# EasyEDA Pro project ProPrj_三轮车_2025-08-24.epro, schematic Schematic1

## Sheets
1 P1: Board Name: 主控板; Create Date: 2024-12-28; Page Name: P1; Project Name: 三轮车; Schematic Name: Schematic1; Update Date: 2025-01-05; Company: 嘉立创EDA; Page Size: A4; Version: V1.0
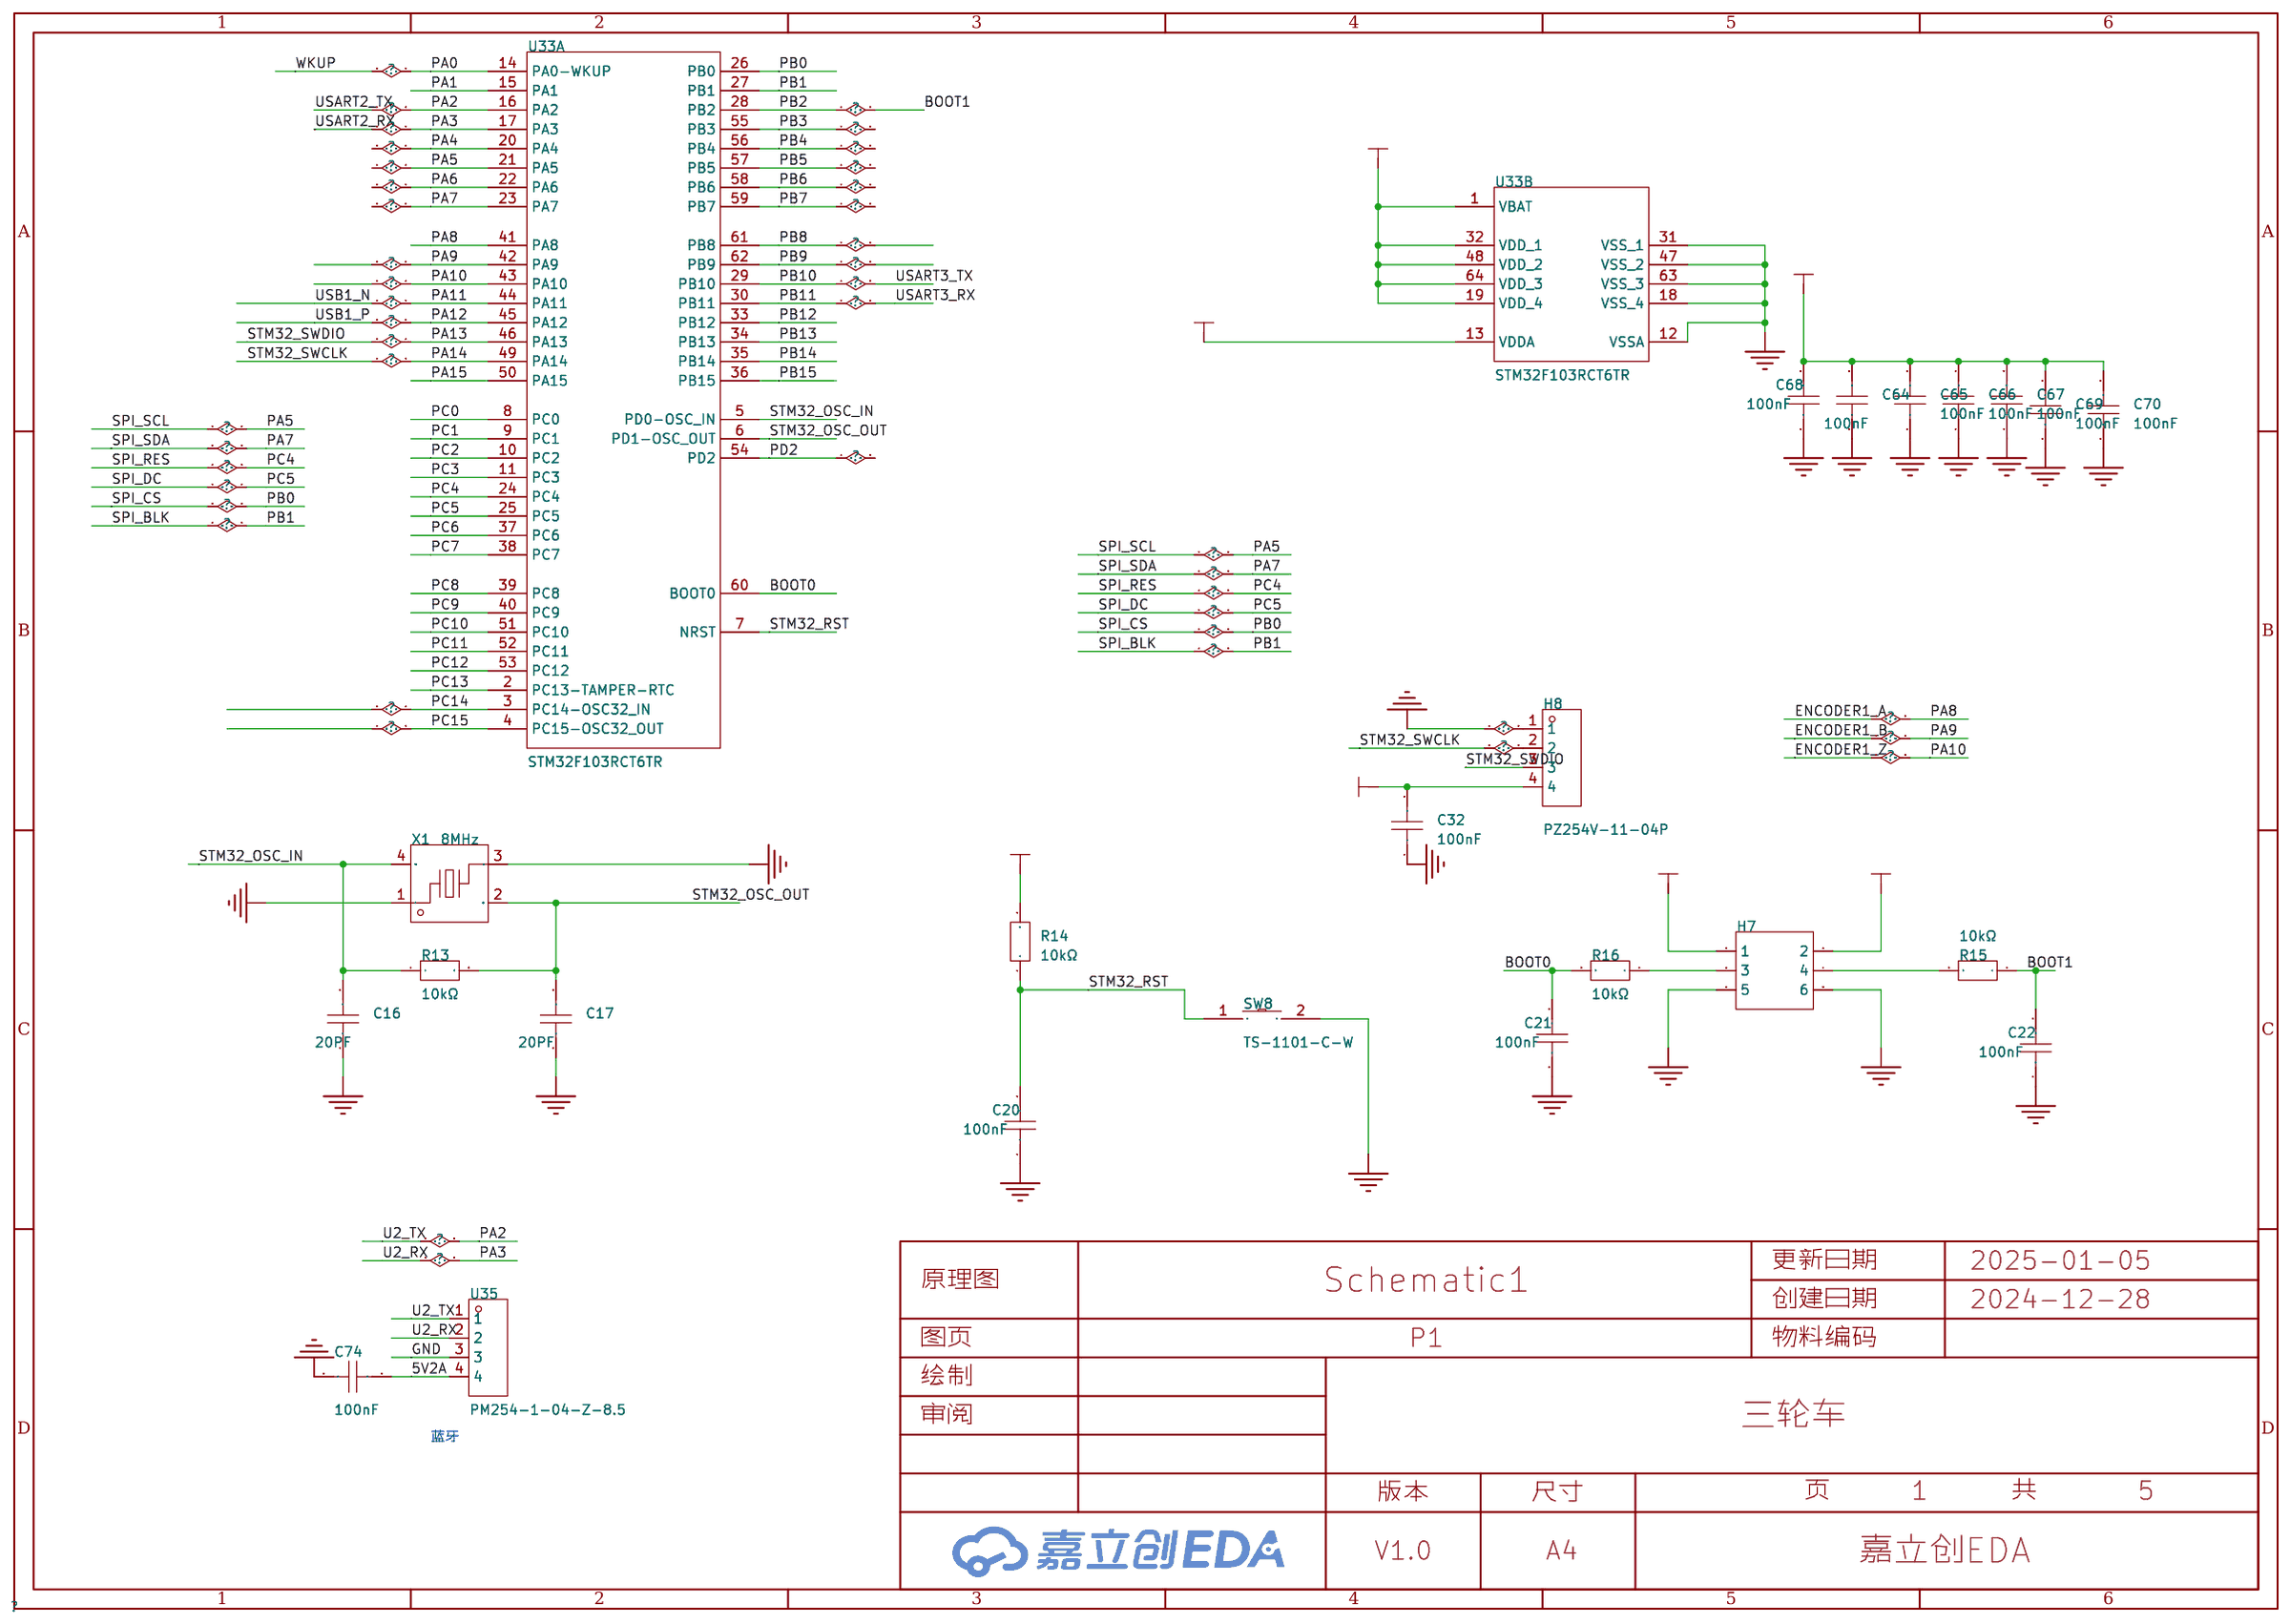
[diagram p0: P1]
2 P3: Page Name: P3; Update Date: 2025-01-06
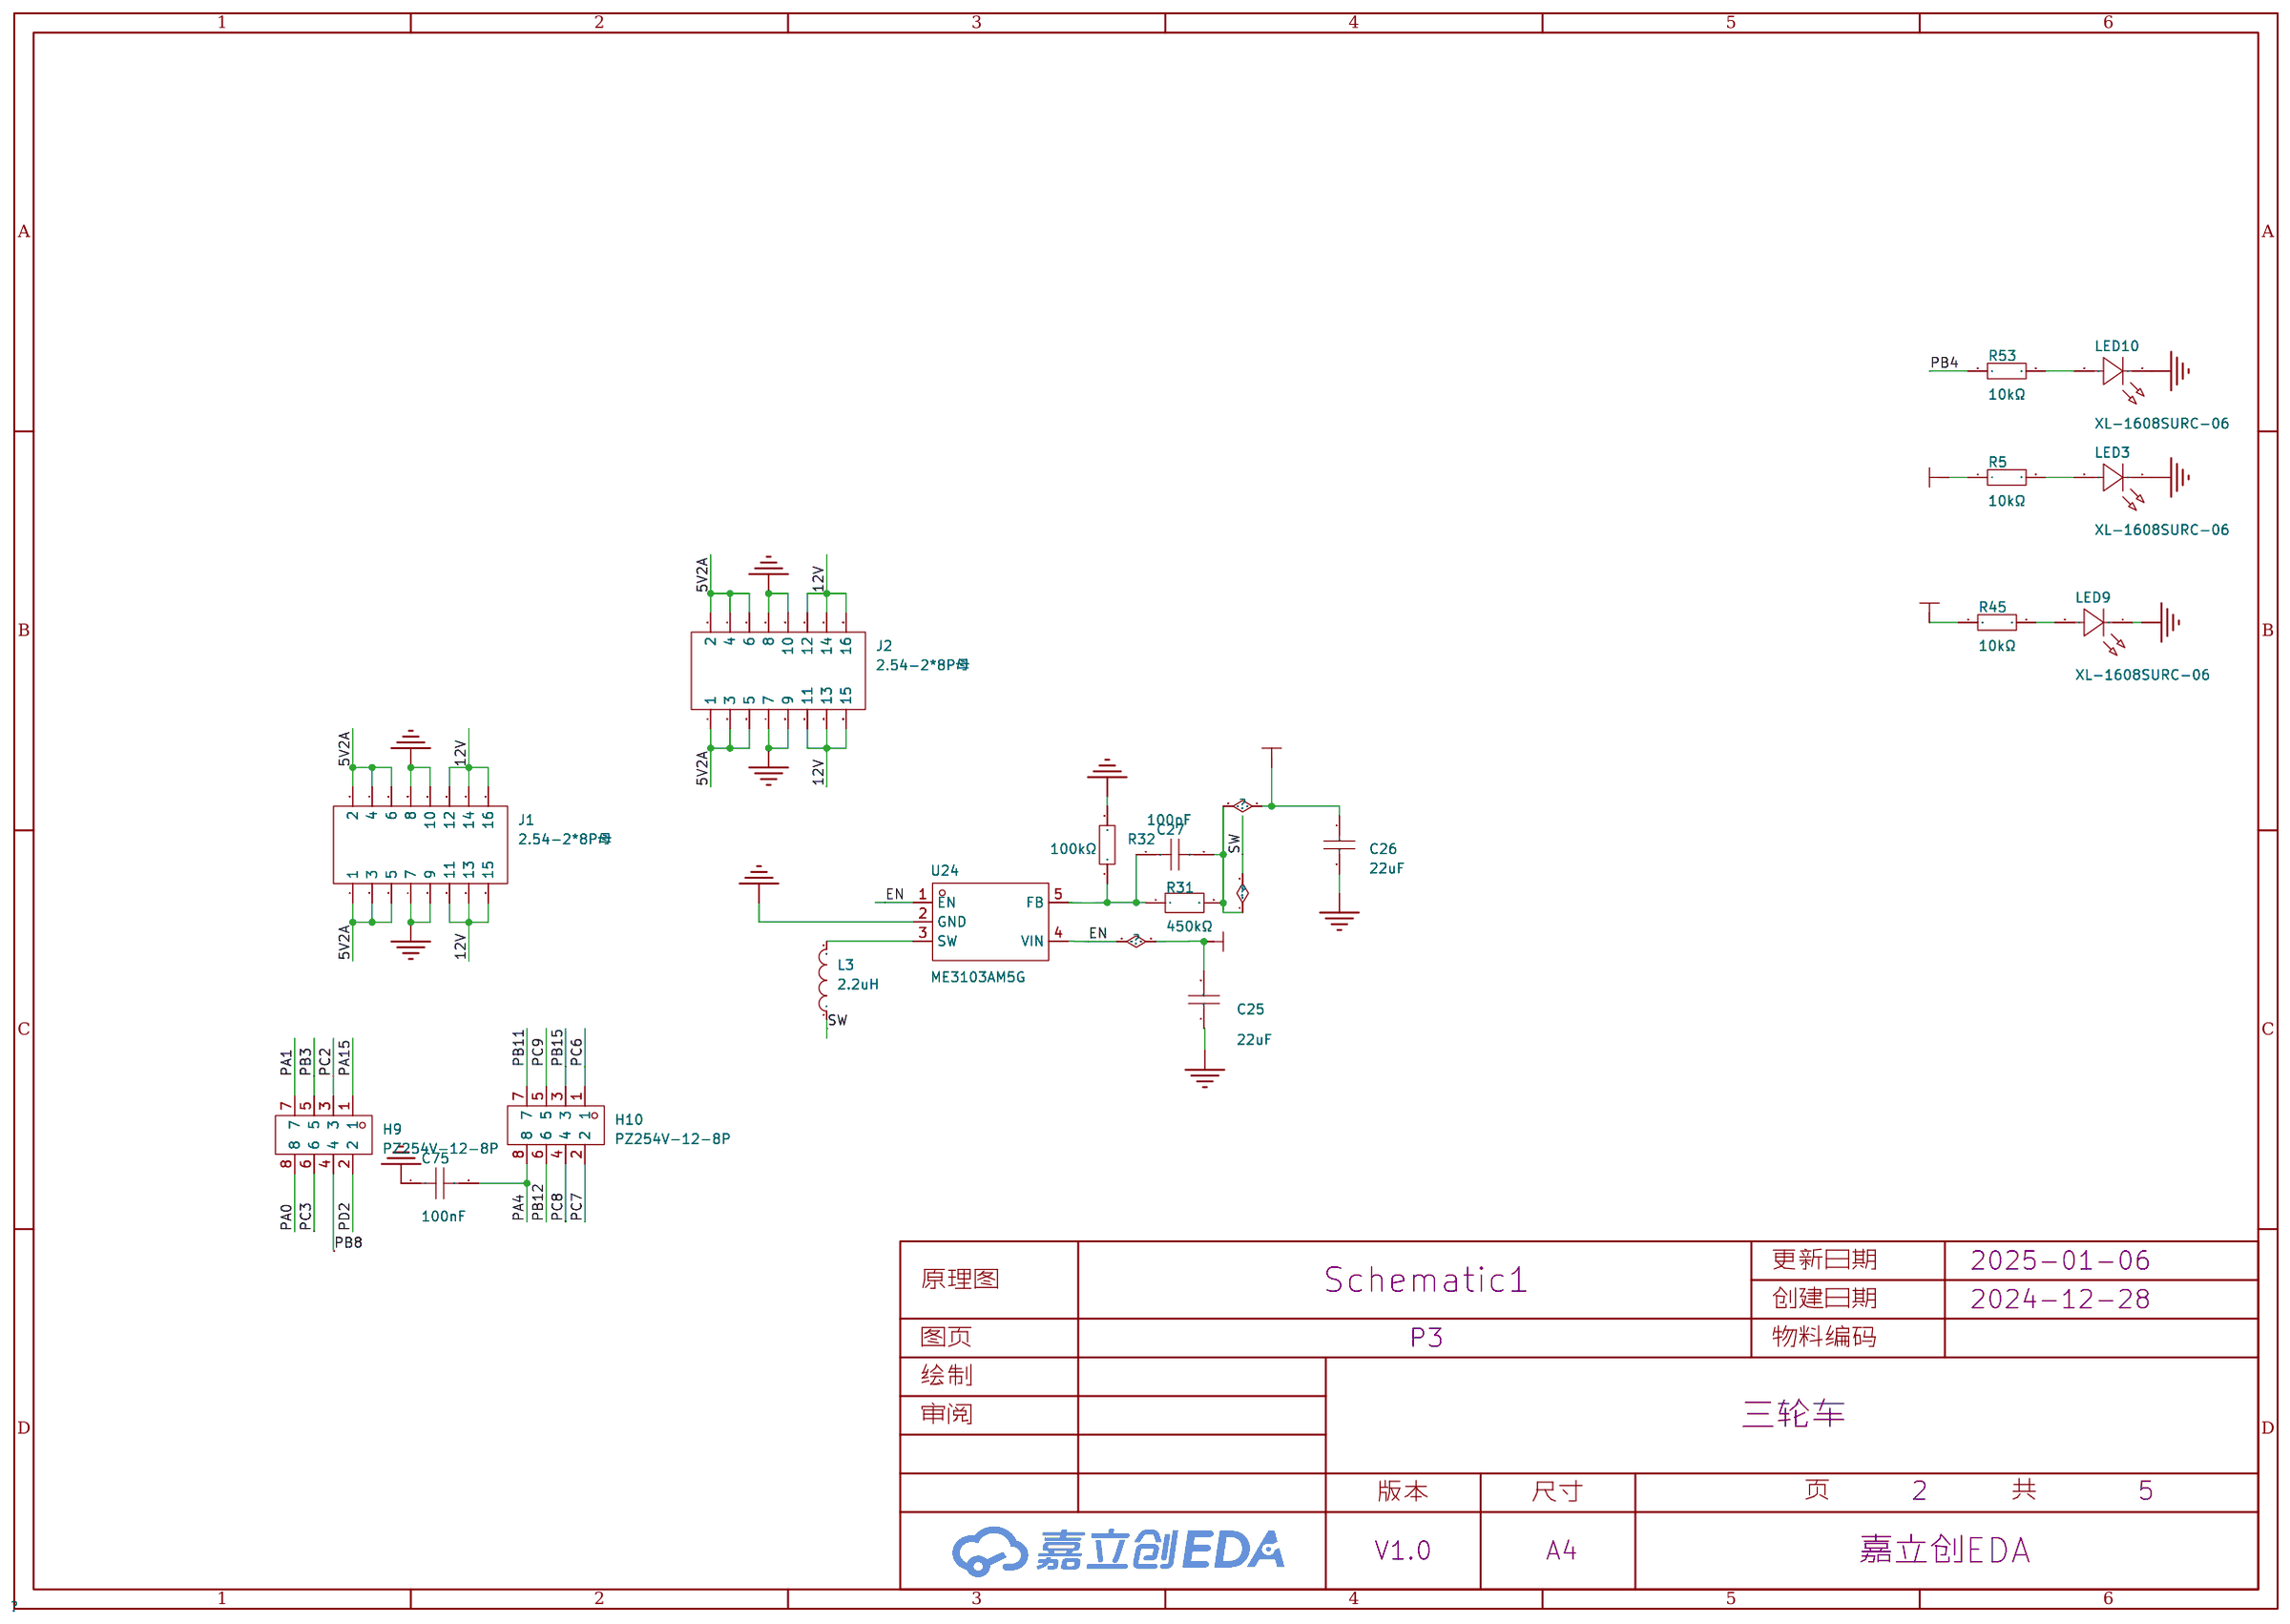
[diagram p1: P3]
3 P5: Page Name: P5
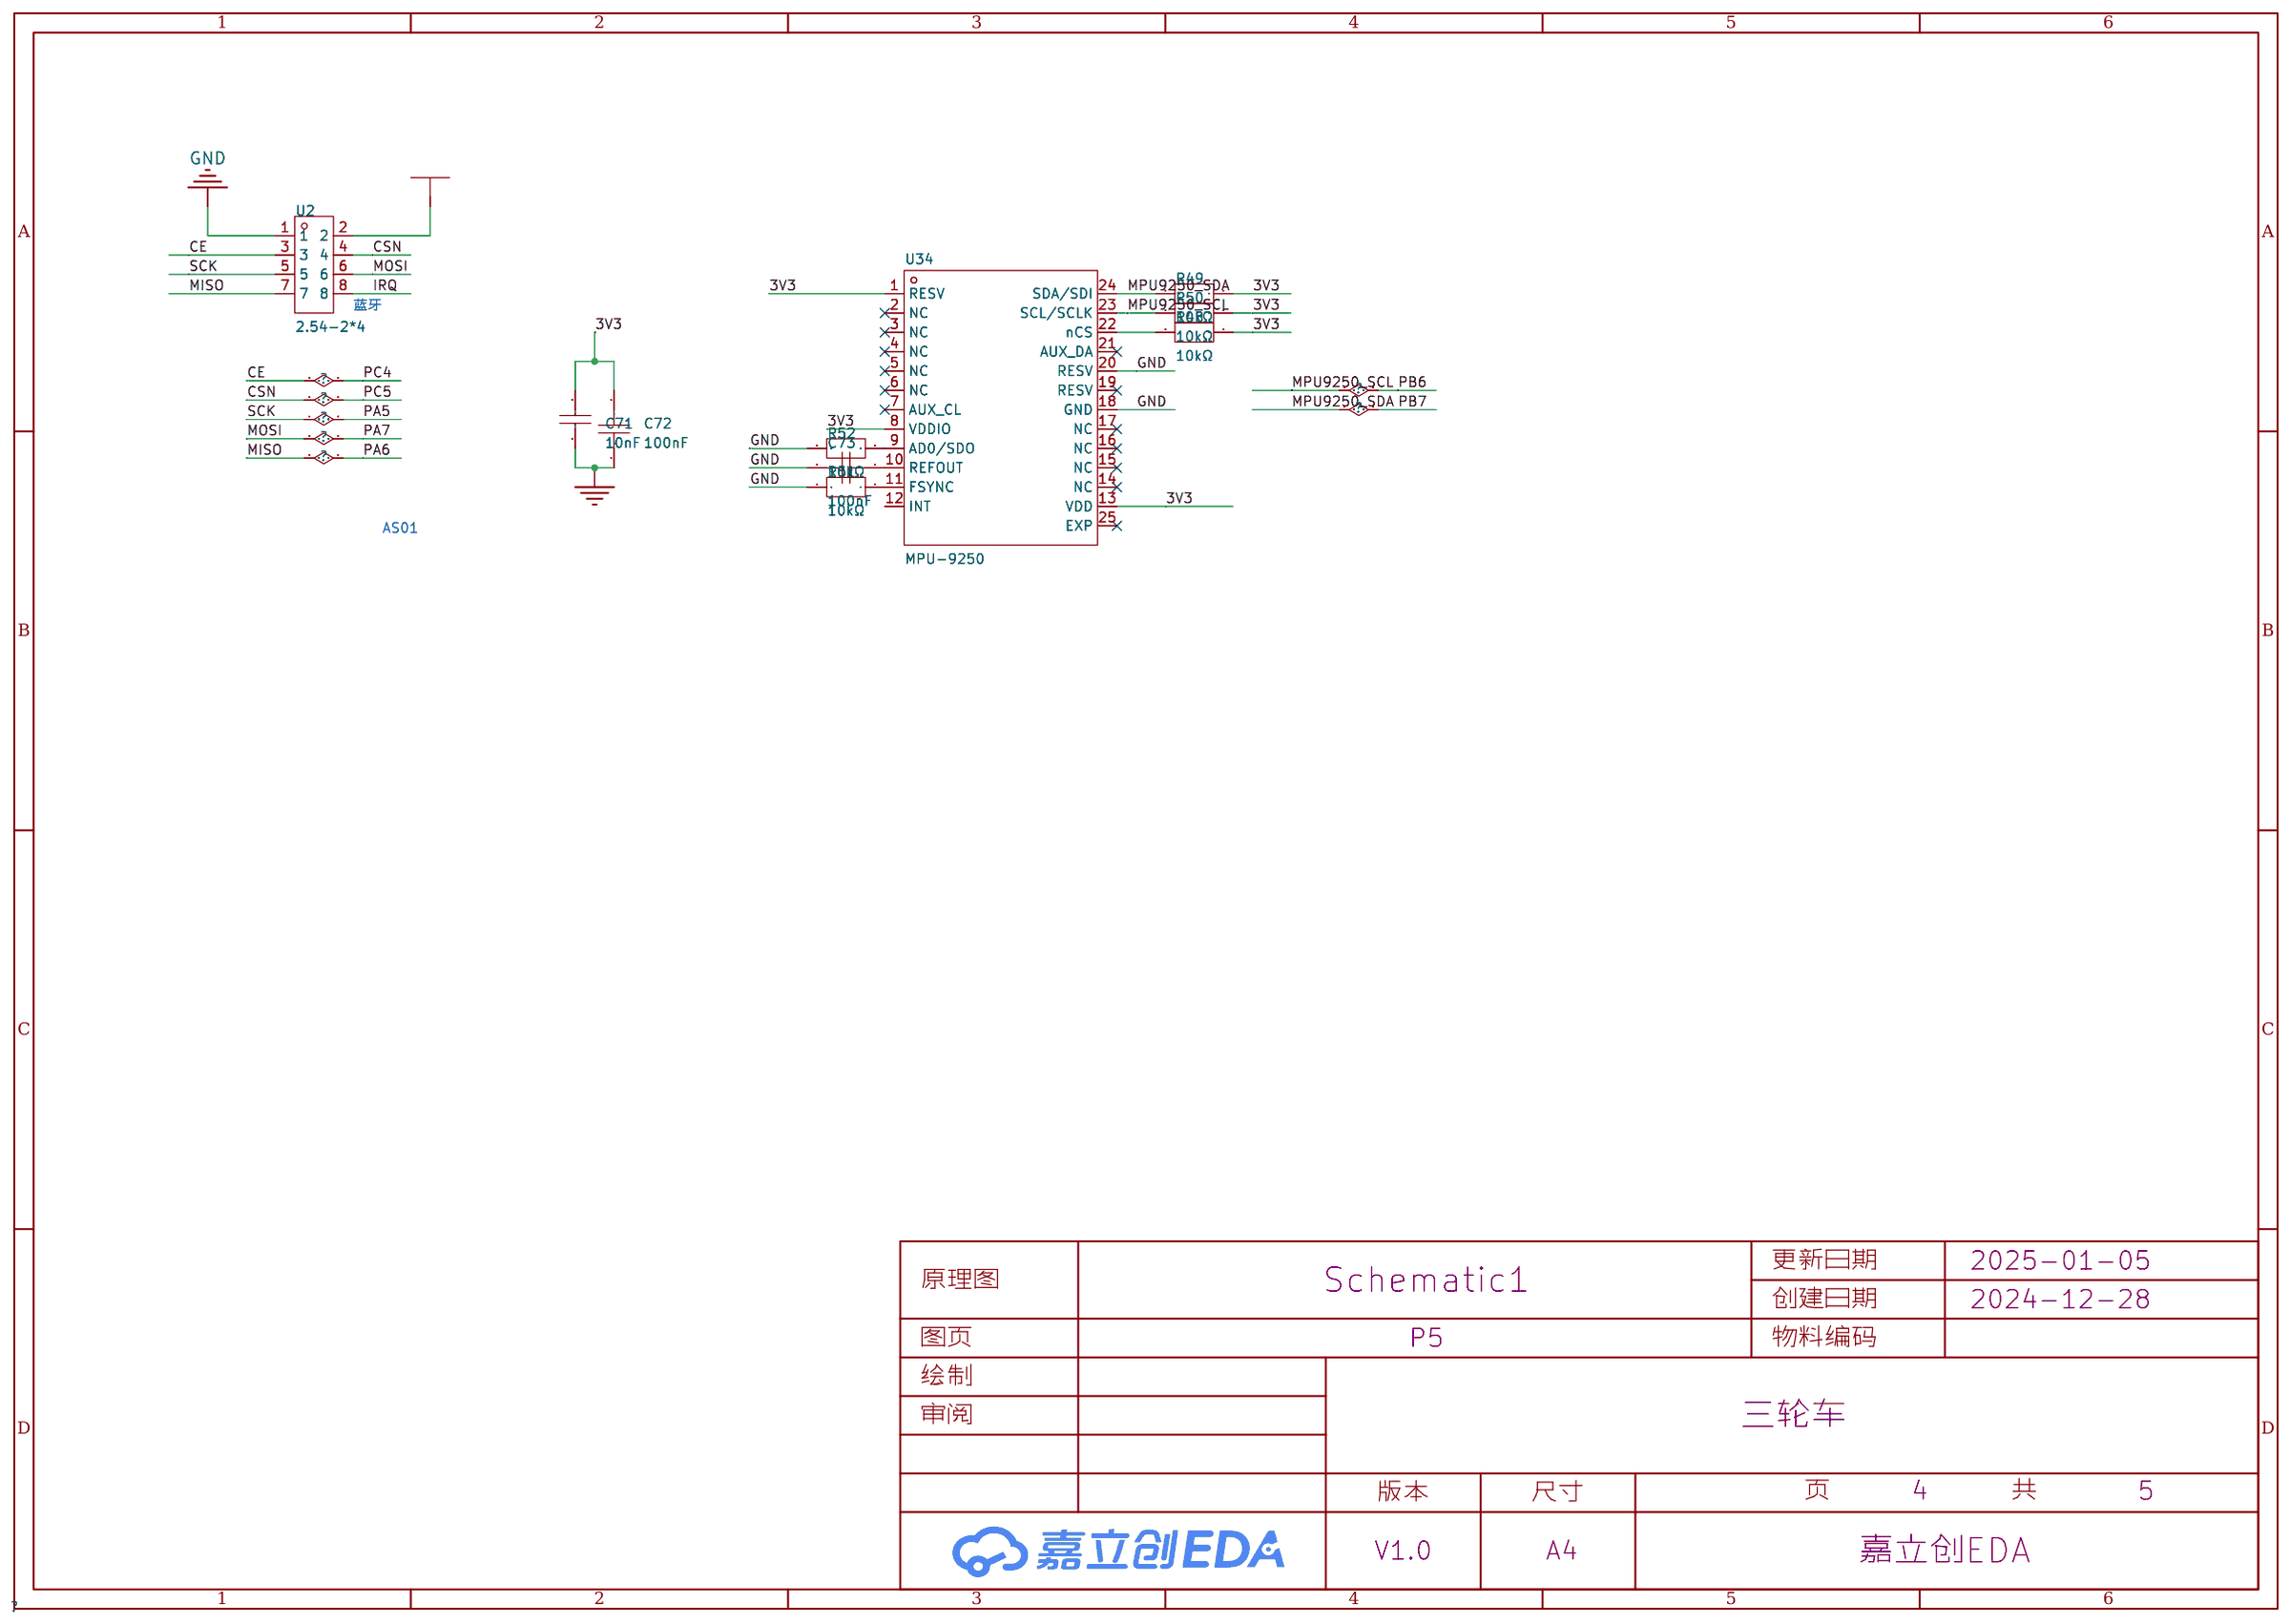
[diagram p2: P5]
4 P6: Create Date: 2025-01-01; Page Name: P6
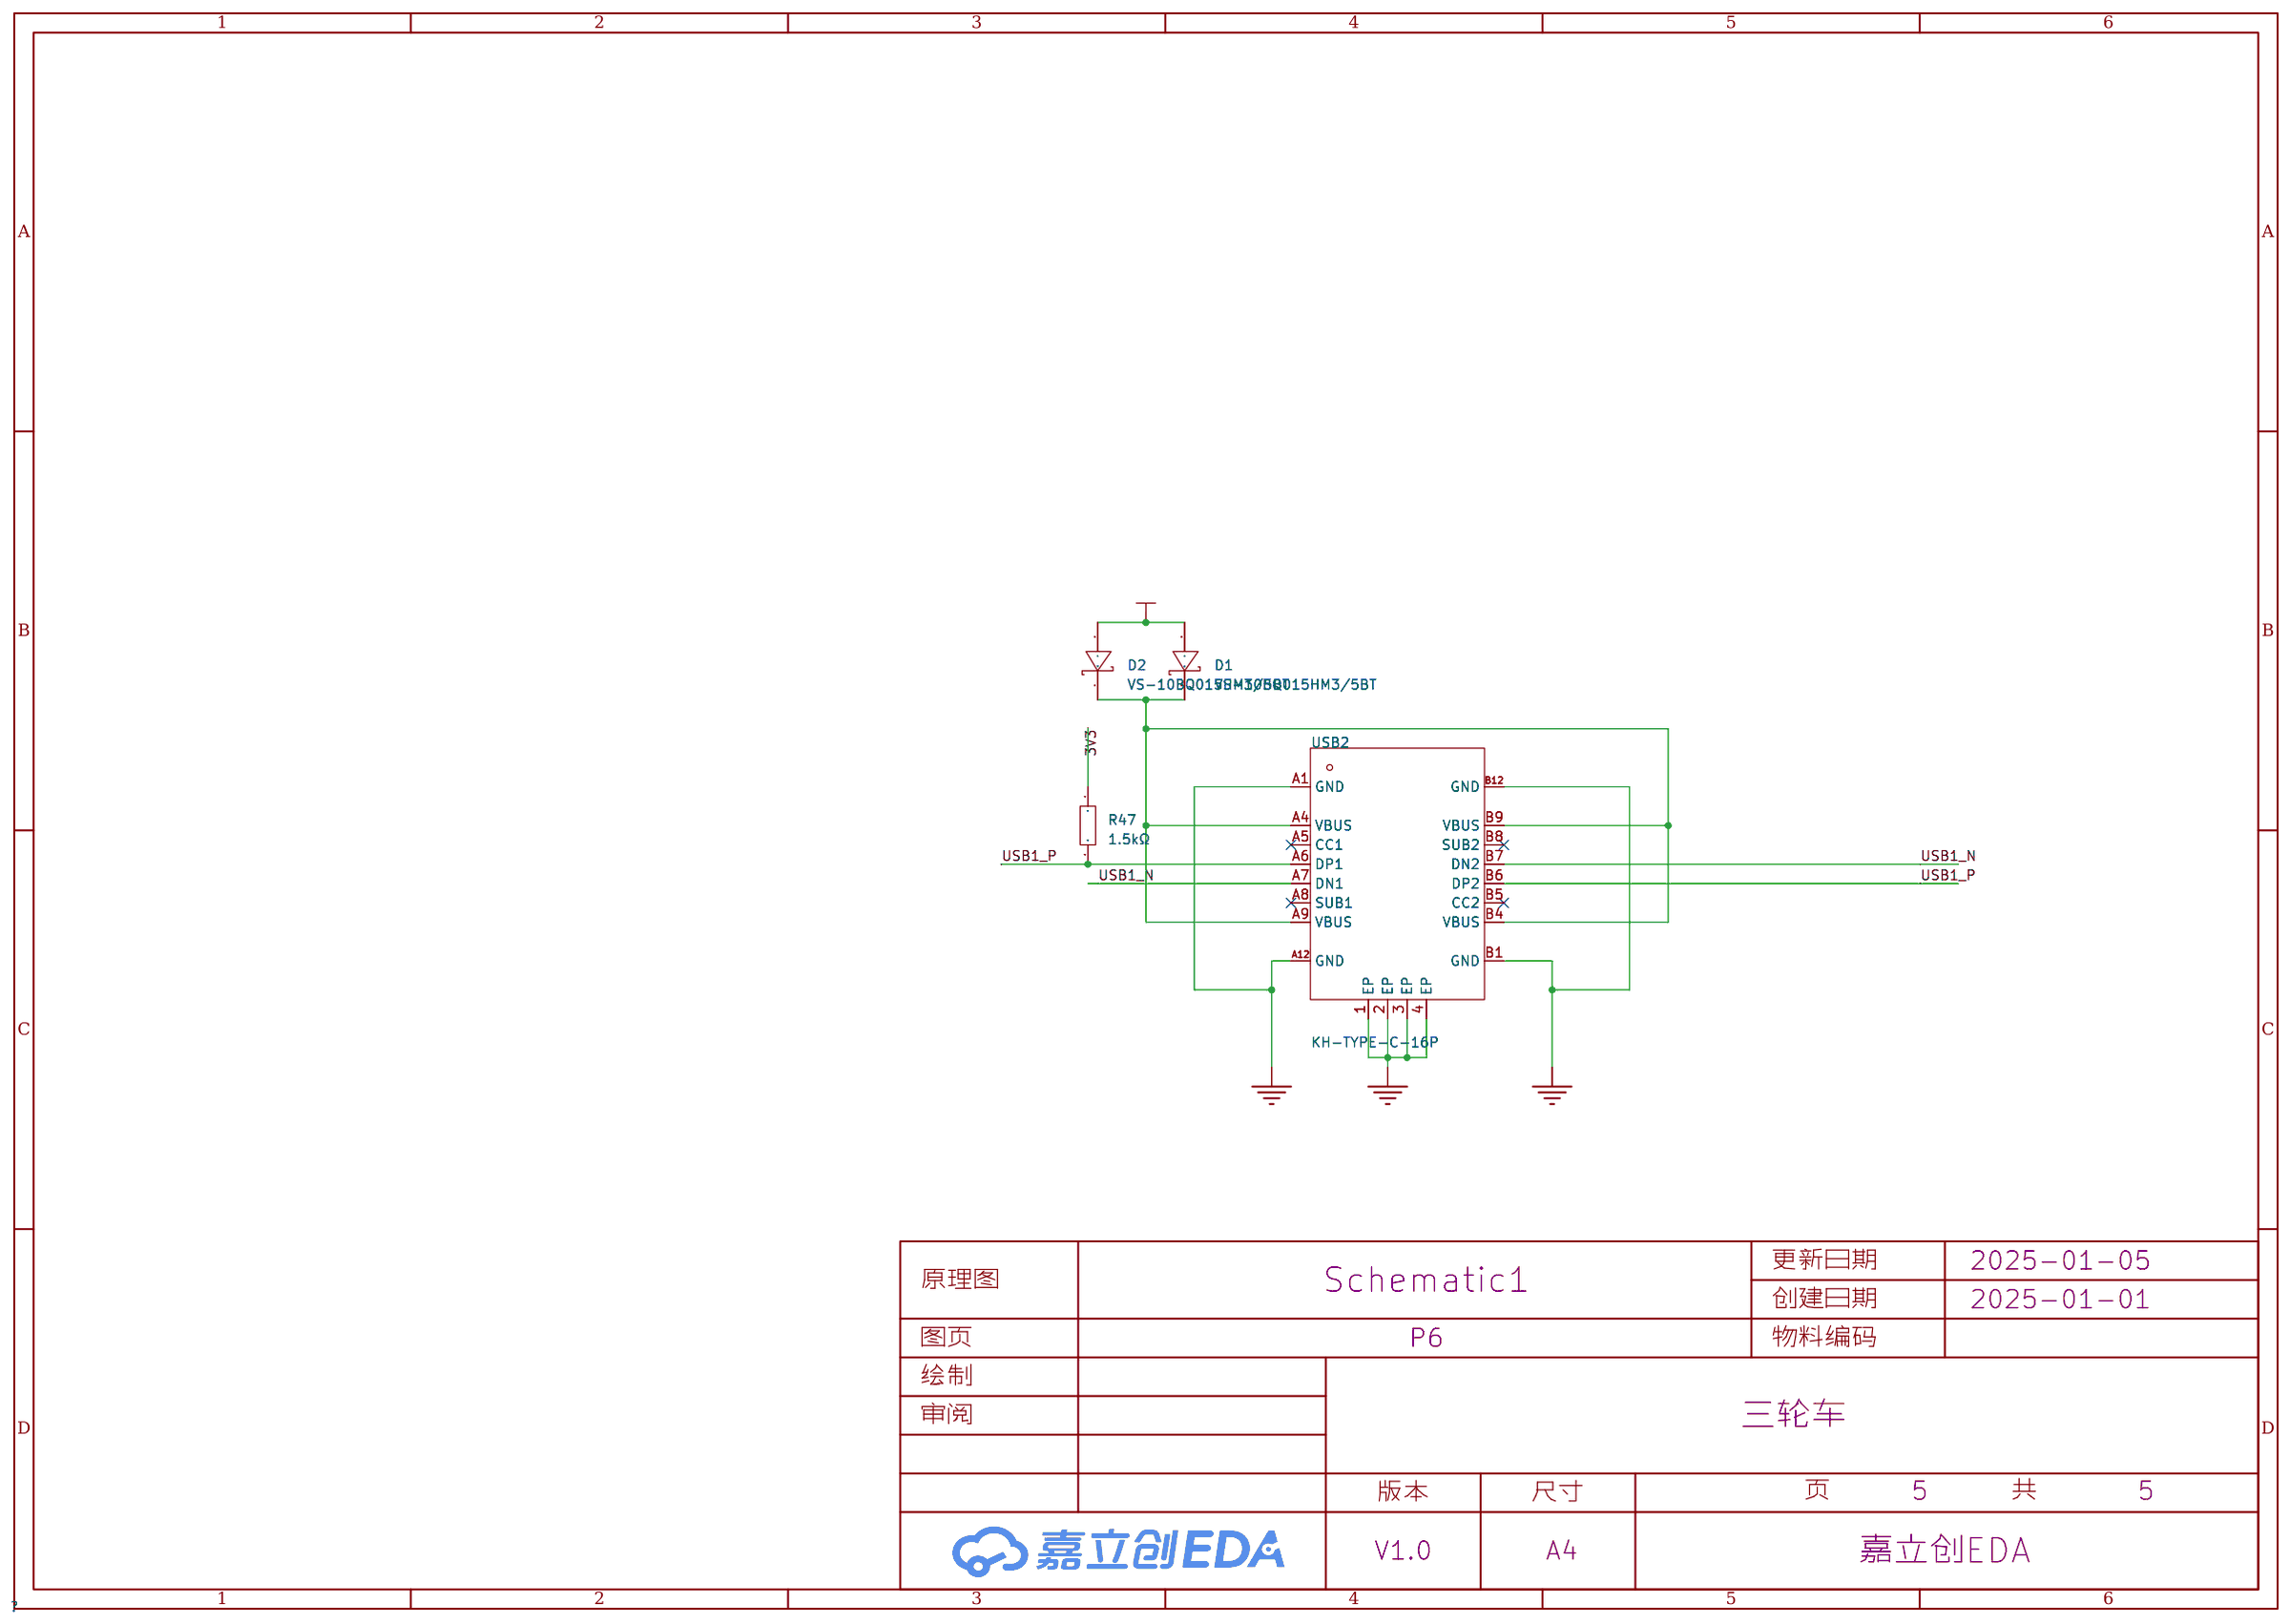
[diagram p3: P6]

## Parts
sheet P1
C16  20PF  [C0603]
C17  20PF  [C0603]
C20  100nF  [C0603]
C21  100nF  [C0603]
C22  100nF  [C0603]
C32  100nF  [C0603]
C64  100nF  [C0603]
C65  100nF  [C0603]
C66  100nF  [C0603]
C67  100nF  [C0603]
C68  100nF  [C0603]
C69  100nF  [C0603]
C70  100nF  [C0603]
C74  100nF  [C0603]
H7  -  [HDR-TH_6P-P2.54-V-F-R2-C3-S2.54]
H8  PZ254V-11-04P  [HDR-TH_4P-P2.54-V-M]
R13  10kΩ  [R0603]
R14  10kΩ  [R0603]
R15  10kΩ  [R0603]
R16  10kΩ  [R0603]
SW8  TS-1101-C-W  [SW-SMD_L6.0-W3.3-LS8.0]
U33  STM32F103RCT6TR  [LQFP-64_L10.0-W10.0-P0.50-LS12.0-BL]  (sections 1,2)
U35  PM254-1-04-Z-8.5  [HDR-TH_4P-P2.54-V-F]
X1  8MHz  [CRYSTAL-SMD_4P-L3.2-W2.5-BL]
sheet P3
C25  22uF  [C1206]
C26  22uF  [C1206]
C27  100pF  [C0603]
C75  100nF  [C0603]
H9  PZ254V-12-8P  [HDR-TH_8P-P2.54-V-M-R2-C4-S2.54]
H10  PZ254V-12-8P  [HDR-TH_8P-P2.54-V-M-R2-C4-S2.54]
J1  2.54-2*8P母  [HDR-TH_16P-P2.54-V-F-R2-C8-S2.54]
J2  2.54-2*8P母  [HDR-TH_16P-P2.54-V-F-R2-C8-S2.54]
L3  2.2uH  [IND-SMD_L2.5-W2.0_MHCD252012A]
LED3  XL-1608SURC-06  [LED0603-RD_RED]
LED9  XL-1608SURC-06  [LED0603-RD_RED]
LED10  XL-1608SURC-06  [LED0603-RD_RED]
R5  10kΩ  [R0603]
R31  450kΩ  [R0402]
R32  100kΩ  [R0603]
R45  10kΩ  [R0603]
R53  10kΩ  [R0603]
U24  ME3103AM5G  [SOT-23-5_L3.0-W1.7-P0.95-LS2.8-BR]
sheet P5
C71  10nF  [C0603]
C72  100nF  [C0603]
C73  100nF  [C0603]
R48  10kΩ  [R0603]
R49  10kΩ  [R0603]
R50  10kΩ  [R0603]
R51  10kΩ  [R0603]
R52  10kΩ  [R0603]
U2  2.54-2*4  [HDR-TH_8P-P2.54-V-F-R2-C4-S2.54]
U34  MPU-9250  [QFN-24_L3.0-W3.0-P0.40-BL-EP]
sheet P6
D1  VS-10BQ015HM3/5BT  [SMB_L4.6-W3.6-LS5.3-RD]
D2  VS-10BQ015HM3/5BT  [SMB_L4.6-W3.6-LS5.3-RD]
R47  1.5kΩ  [R0603]
USB2  KH-TYPE-C-16P  [usb-c-smd_kh-type-c-16p]

## Library data of the parts
C16 C17 C20-C22 C32 C64-C70 C74 C75 = CC0603KRX7R9BB104: 容值:100nF;精度:±10%;额定电压:50V;材质(温度系数):X7R;; LCSC Part Name: 100nF ±10% 50V; Supplier Part: C14663; Manufacturer: YAGEO(国巨); Supplier Footprint: 0603; JLCPCB Part Class: Basic Part; Datasheet: https://atta.szlcsc.com/upload/public/pdf/source/20180910/C282072_33301C7F631E79921B82A8DAC6BCC5B3.pdf; Supplier: LCSC; Tolerance: ±10%; Voltage Rated: 50V; Temperature Coefficient: X7R
H7 = HDR-F_2.54_2x3: Supplier Part: C92272; Supplier Footprint: 插件
H8 = PZ254V-11-04P: 插针结构:1x4P;间距:2.54mm;行距:-;圆针/方针:方针;安装类型:直插;排数:单排;总PIN位数:4P;额定电流:3A;额定电压:250V;配合针长度:6mm;塑高:2.5mm;端接针长度:3mm;触头材质:-;工作温度范围:-40℃~+105℃;颜色:黑色;; LCSC Part Name: 间距:2.54mm 1x4P 直插 方针; Supplier Part: C2691448; Manufacturer: XFCN(兴飞); Supplier Footprint: 插件,P=2.54mm; JLCPCB Part Class: 扩展库; Datasheet: https://atta.szlcsc.com/upload/public/pdf/source/20200309/C492403_F9F19131791D08044AD4F84F8E751A34.pdf; Supplier: LCSC; Pin Structure: 1x4P; Pitch: 2.54mm; Circluar Pins/Square Pins: 方针; Mounting Type: 直插; Number of Rows: 单排; Number of Pins: 4P; Current Rating (Max): 3A; Voltage Rating (Max): 250V; Length of Mating Pin: 6mm; Insulation Height: 2.5mm; Length of End Connection Pin: 3mm; Operating Temperature Range: -40℃~+105℃; Color: 黑色
R13-R16 R48-R52 = FRC0603J103TS: 电阻类型:厚膜电阻;阻值:10kΩ;精度:±5%;功率:100mW;最大工作电压:75V;温度系数:±100ppm/℃;; LCSC Part Name: 10kΩ ±5% 100mW 厚膜电阻; Supplier Part: C2930027; Manufacturer: FOJAN(富捷); Supplier Footprint: 0603; JLCPCB Part Class: 扩展库; Datasheet: https://atta.szlcsc.com/upload/public/pdf/source/20211221/925EC7D7225764EE0046F22065062C87.pdf; Supplier: LCSC; Type: 厚膜电阻; Tolerance: ±5%; Power(Watts): 100mW; Overload Voltage (Max): 75V; Temperature Coefficient: ±100ppm/℃; Operating Temperature Range: -55℃~+155℃
SW8 = TS-1101-C-W: 电路结构:单刀单掷;按钮形状:矩形按钮;作用力:260gf;安装方式:立贴;开关长度:6mm;开关宽度:3.6mm;开关高度:2.5mm;带支架:不带;触点电流:50mA;额定电压(AC):-;额定电压(DC):12V;额定功率:-;绝缘电阻:-;带灯:无;机械寿命:5万次;; LCSC Part Name: 6*3.6*2.5mm 立贴 轻触开关; Supplier Part: C318938; Manufacturer: XKB Connectivity(中国星坤); Supplier Footprint: SMD; JLCPCB Part Class: 扩展库; Datasheet: https://atta.szlcsc.com/upload/public/pdf/source/20200227/C318938_C2E53B1EEDE37D980A33616AC086DE53.pdf; Supplier: LCSC; Circuit: 单刀单掷; Actuator Style: 矩形按钮; Operating Force: 260gf; Mounting Style: 立贴; Switch Length: 6mm; Switch Width: 3.6mm; Switch Height: 2.5mm; Strike Gundam: 不带; Contact Current: 50mA; Voltage Rating (DC): 12V; Actuator/Cap Color: 白色带淡绿; With Lamp: 无; Mechanical Life: 5万次; Operating Temperature: -30℃~+85℃
U33 = STM32F103RCT6TR: CPU内核:ARM-M3;程序存储容量:256KB;RAM总容量:48KB;GPIO端口数量:51;工作电压范围:2V~3.6V;CPU最大主频:72MHz;程序存储器类型:FLASH;; LCSC Part Name: 主流增强型ARM Cortex-M3 MCU，具有256 KB Flash、72 MHz CPU、电机控制、USB和CAN; Supplier Part: C39704; Manufacturer: ST(意法半导体); Supplier Footprint: LQFP-64(10x10); JLCPCB Part Class: 扩展库; Datasheet: https://atta.szlcsc.com/upload/public/pdf/source/20151012/1457707442737.pdf; Supplier: LCSC; CPU Core: ARM-M3; Program Storage Size: 256KB; RAM Size: 48KB; GPIO Ports Number: 51; Operating Voltage Range: 2V~3.6V; CPU Maximum Speed: 72MHz; Program Memory Type: FLASH; Operating Temperature Range: -40℃~+85℃; ADC (Bit): 12bit; DAC (Bit): 12bit; Universal Serial Bus: 有; Peripheral/Function: 看门狗；DMA；看门狗；温度传感器; Watchdog: 有; Infrared Data Association: 有; Low-Voltage Detect: 有; Direct Memory Access: 有; Internal Oscillator: 有
U35 = PM254-1-04-Z-8.5_C2897367: 插孔结构:1x4P;间距:2.54mm;行距:-;圆孔/方孔:方孔;安装类型:直插;排数:单排;总孔位数:4P;额定电流:3A;额定电压:-;插孔方向:顶部;塑高:8.5mm;触头材质:铜合金;工作温度范围:-40℃~+105℃;焊接温度(最大值):260℃@5S;; LCSC Part Name: 1x4P 间距:2.54mm 直插; Supplier Part: C2897367; Manufacturer: HCTL(华灿天禄); Supplier Footprint: 插件,P=2.54mm; JLCPCB Part Class: 扩展库; Datasheet: https://atta.szlcsc.com/upload/public/pdf/source/20230609/534BE42964C679BDE98E061007C4ABD6.pdf; Supplier: LCSC; Holes Structure: 1x4P; Pitch: 2.54mm; Circular Hole / Square Hole: 方孔; Mounting Type: 直插; Number of Rows: 单排; Number of Holes: 4P; Current Rating (Max): 3A; Holes Direction: 顶部; Insulation Height: 8.5mm; Contact Material: 铜合金; Operating Temperature Range: -40℃~+105℃; Soldering Temperature(Max): 260℃@5S
X1 = X32258MSB4SI: 晶振类型:贴片晶振;频率:8MHz;常温频差:±10ppm;外接负载电容:20pF;频率稳定度(全温):±20ppm;; LCSC Part Name: 8MHz ±10ppm 20pF; Supplier Part: C2682774; Manufacturer: YXC(扬兴晶振); Supplier Footprint: SMD3225-4P; JLCPCB Part Class: 扩展库; Datasheet: https://atta.szlcsc.com/upload/public/pdf/source/20240329/19D5F850207469550BEB00D7DFEDBC7A.pdf; Supplier: LCSC; Crystal Type: 贴片晶振; Normal temperature Frequency Tolerance: ±10ppm; External load capacitor: 20pF; Frequency Stability(Full temperature range): ±20ppm; Operating Temperature: -40℃~+85℃
C25 C26 = CL31A226KAHNNNE: 容值:22uF;精度:±10%;额定电压:25V;材质(温度系数):X5R;; LCSC Part Name: 22uF ±10% 25V; Supplier Part: C12891; Manufacturer: SAMSUNG(三星); Supplier Footprint: 1206; JLCPCB Part Class: 基础库; Datasheet: https://atta.szlcsc.com/upload/public/pdf/source/20160218/1457707763339.pdf; Supplier: LCSC; Tolerance: ±10%; Voltage Rated: 25V; Temperature Coefficient: X5R
C27 = CC0603JRNPO9BN101: 容值:100pF;精度:±5%;额定电压:50V;材质(温度系数):NP0;; LCSC Part Name: 100pF ±5% 50V; Supplier Part: C14665; Manufacturer: YAGEO(国巨); Supplier Footprint: 0603; JLCPCB Part Class: 扩展库; Datasheet: https://atta.szlcsc.com/upload/public/pdf/source/20181008/C309499_21CC21451B82C39E3D92150FD6B30293.pdf; Supplier: LCSC; Tolerance: ±5%; Voltage Rated: 50V; Temperature Coefficient: NP0
H9 H10 = PZ254V-12-8P: 插针结构:2x4P;间距:2.54mm;行距:2.54mm;圆针/方针:方针;安装类型:直插;排数:双排;总PIN位数:8P;额定电流:-;额定电压:-;配合针长度:6mm;塑高:2.5mm;端接针长度:3mm;触头材质:黄铜;触头镀层:-;工作温度范围:-40℃~+105℃;颜色:黑色;; LCSC Part Name: 间距:2.54mm 2x4P 直插 方针; Supplier Part: C492421; Manufacturer: XFCN(兴飞); Supplier Footprint: 插件,P=2.54mm; JLCPCB Part Class: 扩展库; Datasheet: https://atta.szlcsc.com/upload/public/pdf/source/20200309/C492421_DC8A206AF99CD7755BD4A5B0BC48200B.pdf; Supplier: LCSC; Pin Structure: 2x4P; Pitch: 2.54mm; Row Spacing: 2.54mm; Circluar Pins/Square Pins: 方针; Mounting Type: 直插; Number of Rows: 双排; Number of Pins: 8P; Length of Mating Pin: 6mm; Insulation Height: 2.5mm; Length of End Connection Pin: 3mm; Contact Material: 黄铜; Operating Temperature Range: -40℃~+105℃; Color: 黑色
J1 J2 = 2.54-2*8P母: 插孔结构:2x8P;间距:2.54mm;行距:2.54mm;安装类型:直插;排数:双排;总孔位数:16P;塑高:-;触头材质:黄铜;触头镀层:-;; LCSC Part Name: 间距:2.54mm 2x8P 直插; Supplier Part: C30734; Manufacturer: BOOMELE(博穆精密); Supplier Footprint: 插件,P=2.54mm; JLCPCB Part Class: 扩展库; Datasheet: https://atta.szlcsc.com/upload/public/pdf/source/20230817/400B44B2F3F98035DBB6B63900A9163B.pdf; Supplier: LCSC; Holes Structure: 2x8P; Pitch: 2.54mm; Row Spacing: 2.54mm; Mounting Type: 直插; Number of Rows: 双排; Number of Holes: 16P; Contact Material: 黄铜
L3 = BDCD002520102R2MS1: 电感值:2.2uH;精度:±20%;额定电流:1.4A;饱和电流(Isat):2.6A;; LCSC Part Name: 2.2uH ±20% 2.6A; Supplier Part: C2838385; Manufacturer: chilisin(奇力新); Supplier Footprint: 1008; JLCPCB Part Class: 扩展库; Datasheet: https://atta.szlcsc.com/upload/public/pdf/source/20210908/A593167DE07B217A909851FD79DFB804.pdf; Supplier: LCSC; Tolerance: ±20%; Rated Current: 1.4A; Saturation Current (Isat): 2.6A; DC Resistance (DCR): 130mΩ
LED3 LED9 LED10 = XL-1608SURC-06: 发光颜色:红色;功率:55mW;正向电流:25mA;主波长:617nm~621nm;透镜颜色:无色透明透镜;色温:-;发光角度:120°;载带方式:正贴;工作温度:-30℃~+85℃;; Supplier Part: C965799; Manufacturer: XINGLIGHT(成兴光); Supplier Footprint: 0603; JLCPCB Part Class: 扩展库; Datasheet: https://atta.szlcsc.com/upload/public/pdf/source/20221102/D860AFDD1CDB02C5A8064103A32707E2.pdf; Supplier: LCSC; Emitted Color: 红色; Power Dissipation: 55mW; Forward Current: 25mA; Dominant Wavelength: 617nm~621nm; Peak Wavelength: 623nm; Lens Color: 无色透明透镜; Viewing Angle: 120°; Mounting Sytle: 正贴; Operating Temperature: -30℃~+85℃
R5 R45 R53 = 0603WAF1002T5E: 电阻类型:厚膜电阻;阻值:10kΩ;精度:±1%;功率:100mW;最大工作电压:75V;温度系数:±100ppm/℃;; LCSC Part Name: 厚膜电阻 10kΩ ±1% 100mW; Supplier Part: C25804; Manufacturer: UNI-ROYAL(厚声); Supplier Footprint: 0603; JLCPCB Part Class: Basic Part; Datasheet: https://atta.szlcsc.com/upload/public/pdf/source/20200306/C422600_1E6D84923E4A46A82E41ADD87F860B5C.pdf; Supplier: LCSC; Type: 厚膜电阻; Tolerance: ±1%; Power(Watts): 100mW; Overload Voltage (Max): 75V; Temperature Coefficient: ±100ppm/℃; Operating Temperature Range: -55℃~+155℃
R31 = FRC0402F4503TS: 电阻类型:厚膜电阻;阻值:450kΩ;精度:±1%;功率:62.5mW;最大工作电压:50V;温度系数:±100ppm/℃;; LCSC Part Name: 450kΩ ±1% 62.5mW 厚膜电阻; Supplier Part: C5159688; Manufacturer: FOJAN(富捷); Supplier Footprint: 0402; JLCPCB Part Class: 扩展库; Datasheet: https://atta.szlcsc.com/upload/public/pdf/source/20211221/925EC7D7225764EE0046F22065062C87.pdf; Supplier: LCSC; Type: 厚膜电阻; Tolerance: ±1%; Power(Watts): 62.5mW; Overload Voltage (Max): 50V; Temperature Coefficient: ±100ppm/℃
R32 = 0603WAF1003T5E: 电阻类型:厚膜电阻;阻值:100kΩ;精度:±1%;功率:100mW;最大工作电压:75V;温度系数:±100ppm/℃;; LCSC Part Name: 100kΩ ±1% 100mW 厚膜电阻; Supplier Part: C25803; Manufacturer: UNI-ROYAL(厚声); Supplier Footprint: 0603; JLCPCB Part Class: 基础库; Datasheet: https://atta.szlcsc.com/upload/public/pdf/source/20200306/C422600_1E6D84923E4A46A82E41ADD87F860B5C.pdf; Supplier: LCSC; Type: 厚膜电阻; Tolerance: ±1%; Power(Watts): 100mW; Overload Voltage (Max): 75V; Temperature Coefficient: ±100ppm/℃; Operating Temperature Range: -55℃~+155℃
U24 = ME3103AM5G: 功能类型:降压型;输入电压:2.5V~5.5V;输出电压:600mV~5.5V;输出电流(最大值):1A;; Supplier Part: C236734; Manufacturer: MICRONE(南京微盟); Supplier Footprint: SOT-23-5; JLCPCB Part Class: 扩展库; Datasheet: https://atta.szlcsc.com/upload/public/pdf/source/20180709/C236734_1C8BBF9BA334136D9FAF85020467E81B.pdf; Supplier: LCSC; Function: 降压型; Input Voltage: 2.5V~5.5V; Output Voltage: 600mV~5.5V; Output Current (Max): 1A; Switching Frequency: 1.5MHz; Synchronous Rectification: 是; Number of Outputs: 1; Topology: 降压式; Switch tube (built-in/external): 内置
C71 = CC0603KRX7R9BB103: 容值:10nF;精度:±10%;额定电压:50V;材质(温度系数):X7R;; LCSC Part Name: 10nF ±10% 50V; Supplier Part: C100042; Manufacturer: YAGEO(国巨); Supplier Footprint: 0603; JLCPCB Part Class: 扩展库; Datasheet: https://atta.szlcsc.com/upload/public/pdf/source/20181008/C309510_22F155564471FAF6A489F7D68F34234E.pdf; Supplier: LCSC; Tolerance: ±10%; Voltage Rated: 50V; Temperature Coefficient: X7R
C72 C73 = CGA0603X7R104K500JT: 容值:100nF;精度:±10%;额定电压:50V;材质(温度系数):X7R;; LCSC Part Name: 100nF ±10% 50V; Supplier Part: C6119867; Manufacturer: HRE(芯声); Supplier Footprint: 0603; JLCPCB Part Class: 扩展库; Supplier: LCSC; Tolerance: ±10%; Voltage Rated: 50V; Temperature Coefficient: X7R
U2 = 2.54-2*4: 插孔结构:2x4P;间距:2.54mm;行距:2.54mm;圆孔/方孔:方孔;安装类型:直插;排数:双排;总孔位数:8P;额定电流:2.5A;额定电压:-;插孔方向:顶部;塑高:8.5mm;工作温度范围:-40℃~+105℃;; LCSC Part Name: 间距:2.54mm 2x4P 直插; Supplier Part: C2977588; Manufacturer: ZHOURI(洲日); Supplier Footprint: 插件,P=2.54mm; JLCPCB Part Class: 扩展库; Datasheet: https://atta.szlcsc.com/upload/public/pdf/source/20220328/363EB391BC0EB759CF231FC910753CBE.pdf; Supplier: LCSC; Holes Structure: 2x4P; Pitch: 2.54mm; Row Spacing: 2.54mm; Circular Hole / Square Hole: 方孔; Mounting Type: 直插; Number of Rows: 双排; Number of Holes: 8P; Current Rating (Max): 2.5A; Holes Direction: 顶部; Insulation Height: 8.5mm; Operating Temperature Range: -40℃~+105℃
U34 = MPU-9250: 9轴传感器; LCSC Part Name: MPU-9250 停产; Supplier Part: C71459; Manufacturer: TDK InvenSense(应美盛); Supplier Footprint: QFN-24-EP(3x3); JLCPCB Part Class: 扩展库; Datasheet: https://atta.szlcsc.com/upload/public/pdf/source/20170810/C71459_1502335389644879978.pdf; Supplier: LCSC
D1 D2 = VS-10BQ015HM3/5BT: 正向压降(Vf):210mV@1A;直流反向耐压(Vr):15V;整流电流:1A;; LCSC Part Name: 电压:15V 电流:1A; Supplier Part: C413465; Manufacturer: VISHAY(威世); Supplier Footprint: DO-214AA(SMB); JLCPCB Part Class: 扩展库; Datasheet: https://atta.szlcsc.com/upload/public/pdf/source/20190819/C413465_3D2B1A8C7366D4425AB887DF85498F89.pdf; Supplier: LCSC; Forward Voltage (Vf@If): 210mV@1A; Reverse Voltage (Vr): 15V; Rectified Current: 1A; Reverse Leakage Current (Ir): 500uA@15V
R47 = 0603WAF1501T5E: 电阻类型:厚膜电阻;阻值:1.5kΩ;精度:±1%;功率:100mW;最大工作电压:75V;温度系数:±100ppm/℃;; LCSC Part Name: 1.5kΩ ±1% 100mW 厚膜电阻; Supplier Part: C22843; Manufacturer: UNI-ROYAL(厚声); Supplier Footprint: 0603; JLCPCB Part Class: 基础库; Datasheet: https://atta.szlcsc.com/upload/public/pdf/source/20200306/C422600_1E6D84923E4A46A82E41ADD87F860B5C.pdf; Supplier: LCSC; Type: 厚膜电阻; Tolerance: ±1%; Power(Watts): 100mW; Overload Voltage (Max): 75V; Temperature Coefficient: ±100ppm/℃; Operating Temperature Range: -55℃~+155℃
USB2 = KH-TYPE-C-16P: 连接器类型:Type-C;标准:-;公母:母;端口数量:1;触点数量:16P;安装方式:卧贴;额定电流 - 电源:3A;工作温度范围:-40℃~+85℃;; LCSC Part Name: Type-C 母 卧贴; Supplier Part: C709357; Manufacturer: kinghelm(金航标); Supplier Footprint: SMD; JLCPCB Part Class: 扩展库; Datasheet: https://atta.szlcsc.com/upload/public/pdf/source/20200911/C709357_AA8DCEB38BB20E3035A7ED7AE7667837.pdf; Supplier: LCSC; Connector Type: Type-C; Gender: 母; Number of Ports: 1; Number of Contacts: 16P; Mounting Style: 卧贴; Current Rating - Power (Max): 3A; Operating Temperature Range: -40℃~+85℃

## Nets
3V3: C26.1 C27.2 C32.2 C64.2 C65.2 C66.2 C67.2 C68.2 C69.2 C70.2 C71.2 C72.2 H7.1 H7.2 H8.4 L3.1 R14.2 R31.2 R45.1 R47.1 R48.1 R49.1 R50.1 U2.2 U33.1(VBAT) U33.13(VDDA) U33.19(VDD_4) U33.32(VDD_1) U33.48(VDD_2) U33.64(VDD_3) U34.1(RESV) U34.8(VDDIO) U34.13(VDD)
5V2A: C25.2 C74.2 D1.2(A) D2.2(A) J1.1 J1.2 J1.3 J1.4 J1.5 J1.6 J2.1 J2.2 J2.3 J2.4 J2.5 J2.6 R5.1 U24.1(EN) U24.4(VIN) U35.4
12V: J1.11 J1.12 J1.13 J1.14 J1.15 J1.16 J2.11 J2.12 J2.13 J2.14 J2.15 J2.16
GND: C20.1 C21.1 C22.1 C25.1 C26.2 C32.1 C64.1 C65.1 C66.1 C67.1 C68.1 C69.1 C70.1 C71.1 C72.1 C73.2 C74.1 C75.1 H7.5 H7.6 H8.1 J1.7 J1.8 J1.9 J1.10 J2.7 J2.8 J2.9 J2.10 LED3.1(K) LED9.1(K) LED10.1(K) R32.2 R51.2 R52.2 SW8.2 U2.1 U24.2(GND) U33.12(VSSA) U33.18(VSS_4) U33.31(VSS_1) U33.47(VSS_2) U33.63(VSS_3) U34.18(GND) U34.20(RESV) U35.3 USB2.1(EP) USB2.2(EP) USB2.3(EP) USB2.4(EP) USB2.A1(GND) USB2.A12(GND) USB2.B1(GND) USB2.B12(GND)
BOOT0: C21.2 R16.2 U33.60(BOOT0)
BOOT1: C22.2 R15.1 U33.28(PB2)
CE: U2.3 U33.24(PC4)
CSN: U2.4 U33.25(PC5)
ENCODER1_A: U33.41(PA8)
ENCODER1_B: U33.42(PA9)
ENCODER1_Z: U33.43(PA10)
IRQ: U2.8
J_GND: C16.1 C17.1 X1.1 X1.3
MISO: U2.7 U33.22(PA6)
MOSI: U2.6 U33.23(PA7)
MPU9250_SCL: R50.2 U33.58(PB6) U34.23(SCL/SCLK)
MPU9250_SDA: R49.2 U33.59(PB7) U34.24(SDA/SDI)
PA0: H9.8 U33.14(PA0-WKUP)
PA1: H9.7 U33.15(PA1)
PA2: U33.16(PA2) U35.1
PA3: U33.17(PA3) U35.2
PA4: C75.2 H10.8 U33.20(PA4)
PA5: U2.5 U33.21(PA5)
PA11: U33.44(PA11) USB2.A7(DN1) USB2.B7(DN2)
PA12: R47.2 U33.45(PA12) USB2.A6(DP1) USB2.B6(DP2)
PA13: H8.3 U33.46(PA13)
PA14: H8.2 U33.49(PA14)
PA15: H9.1 U33.50(PA15)
PB0: U33.26(PB0)
PB1: U33.27(PB1)
PB3: H9.5 U33.55(PB3)
PB4: R53.1 U33.56(PB4)
PB5: U33.57(PB5)
PB8: H9.4 U33.61(PB8)
PB9: U33.62(PB9)
PB10: U33.29(PB10)
PB11: H10.7 U33.30(PB11)
PB12: H10.6 U33.33(PB12)
PB13: U33.34(PB13)
PB14: U33.35(PB14)
PB15: H10.3 U33.36(PB15)
PC0: U33.8(PC0)
PC1: U33.9(PC1)
PC2: H9.3 U33.10(PC2)
PC3: H9.6 U33.11(PC3)
PC6: H10.1 U33.37(PC6)
PC7: H10.2 U33.38(PC7)
PC8: H10.4 U33.39(PC8)
PC9: H10.5 U33.40(PC9)
PC10: U33.51(PC10)
PC11: U33.52(PC11)
PC12: U33.53(PC12)
PC13: U33.2(PC13-TAMPER-RTC)
PC14: U33.3(PC14-OSC32_IN)
PC15: U33.4(PC15-OSC32_OUT)
PD2: H9.2 U33.54(PD2)
STM32_OSC_IN: C16.2 R13.1 U33.5(PD0-OSC_IN) X1.4(GND)
STM32_OSC_OUT: C17.2 R13.2 U33.6(PD1-OSC_OUT) X1.2(GND)
STM32_RST: C20.2 R14.1 SW8.1 U33.7(NRST)
$1N2704: H7.4 R15.2
$1N2705: H7.3 R16.1
$3N1247: LED3.2(A) R5.2
$3N1262: LED9.2(A) R45.2
$3N6377: LED10.2(A) R53.2
$5N2391: R48.2 U34.22(nCS)
$5N2776: C73.1 U34.10(REFOUT)
$5N2819: R51.1 U34.11(FSYNC)
$5N2858: R52.1 U34.9(AD0/SDO)
$6N1315: D1.1(C) D2.1(C) USB2.A4(VBUS) USB2.A9(VBUS) USB2.B4(VBUS) USB2.B9(VBUS)
Net-(C27-1): C27.1 R32.1 U24.5(FB)

Not connected (* = marked no-connect by the designer): L3 2; R31 1; U24 3(SW); U34 2(NC)* 3(NC)* 4(NC)* 5(NC)* 6(NC)* 7(AUX_CL)* 12(INT) 14(NC)* 15(NC)* 16(NC)* 17(NC)* 19(RESV)* 21(AUX_DA)* 25(EXP)*; USB2 A5(CC1)* A8(SUB1)* B5(CC2)* B8(SUB2)*

## Notes on the sheets
sheet 1
- 蓝牙
sheet 3
- 蓝牙
- AS01
